# Altium schematic sheet EnergyMeter_ADE9153.SchDoc
size A; SheetNumber: 2; SheetTotal: 2
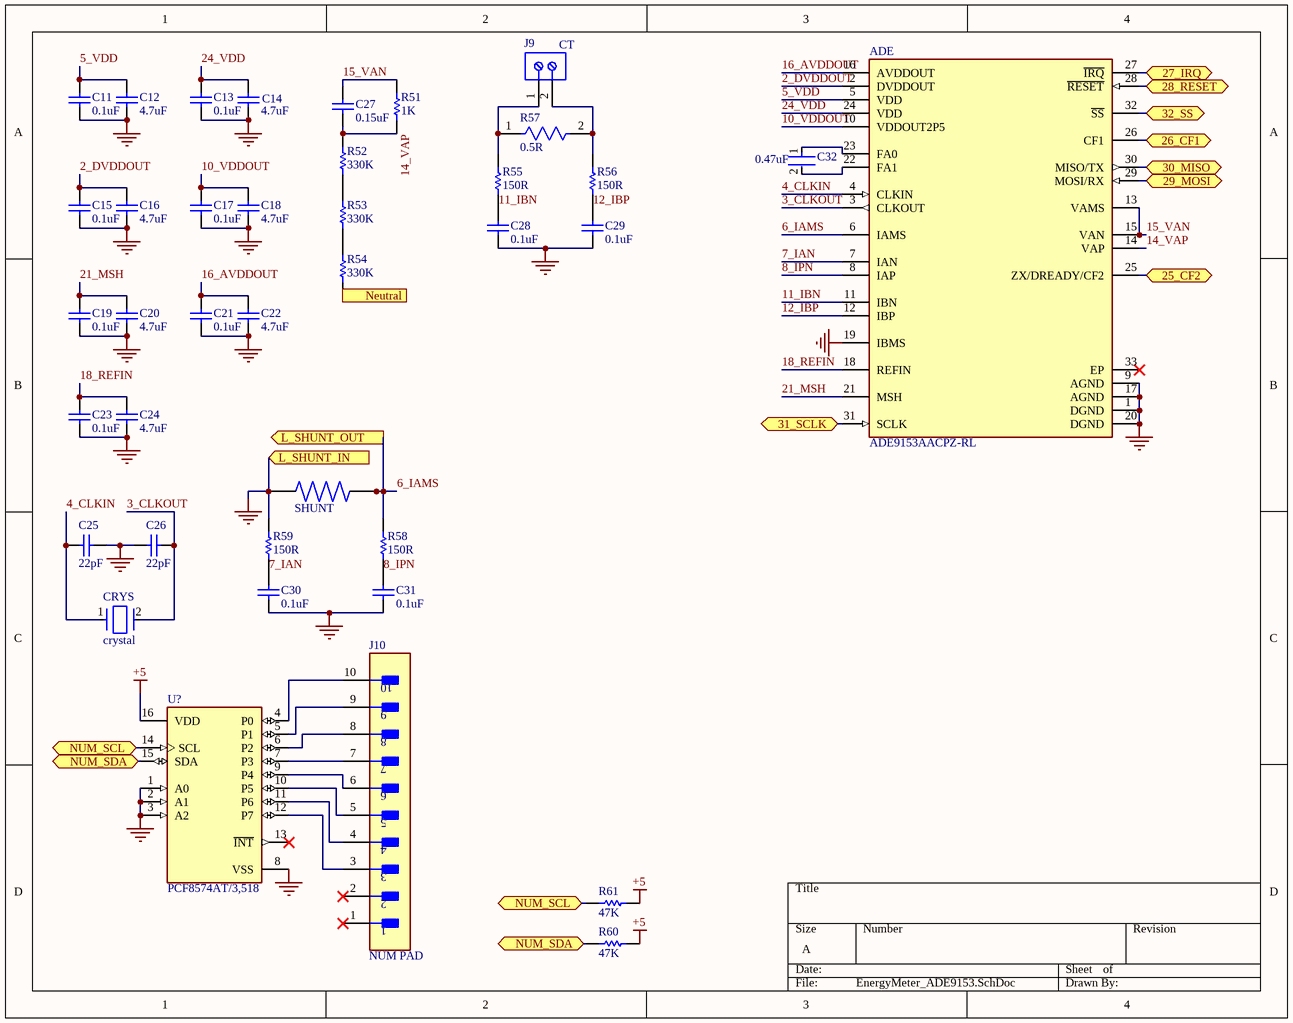
[diagram p0: EnergyMeter_ADE9153.SchDoc]

## Parts
ADE  ADE9153AACPZ-RL  [FP-CP-32-12-MFG]
C11  0.1uF  [CAPC2013X135X45ML10T25]
C12  4.7uF  [CAPC2013X135X45ML10T25]
C13  0.1uF  [CAPC2013X135X45ML10T25]
C14  4.7uF  [CAPC2013X135X45ML10T25]
C15  0.1uF  [CAPC2013X135X45ML10T25]
C16  4.7uF  [CAPC2013X135X45ML10T25]
C17  0.1uF  [CAPC2013X135X45ML10T25]
C18  4.7uF  [CAPC2013X135X45ML10T25]
C19  0.1uF  [CAPC2013X135X45ML10T25]
C20  4.7uF  [CAPC2013X135X45ML10T25]
C21  0.1uF  [CAPC2013X135X45ML10T25]
C22  4.7uF  [CAPC2013X135X45ML10T25]
C23  0.1uF  [CAPC2013X135X45ML10T25]
C24  4.7uF  [CAPC2013X135X45ML10T25]
C25  22pF  [CAPC2013X115X51NL20T26]
C26  22pF  [CAPC2013X115X51NL20T26]
C27  0.15uF  [CAPC2013X140X50LL20T25]
C28  0.1uF  [CAPC2013X135X45ML10T25]
C29  0.1uF  [CAPC2013X135X45ML10T25]
C30  0.1uF  [CAPC2013X135X45ML10T25]
C31  0.1uF  [CAPC2013X135X45ML10T25]
C32  0.47uF  [FP-C0805C-DN-MFG]
CRYS  crystal  [FP-CSM-7XDU-MFG]
J9  CT  [691214110002]
J10  NUM PAD  [FP-B10B-XH-A_LF_SN-MFG]
R51  1K  [RESC2013X60X35ML10T20]
R52  330K  [RESC2013X70X40LL20T20]
R53  330K  [RESC2013X70X40LL20T20]
R54  330K  [RESC2013X70X40LL20T20]
R55  150R  [RESC2013X60X40NL20T25]
R56  150R  [RESC2013X60X40NL20T25]
R57  0.5R  [FP-CSR0805-MFG]
R58  150R  [RESC2013X60X40NL20T25]
R59  150R  [RESC2013X60X40NL20T25]
R60  47K  [RESC2013X60X40ML20T25]
R61  47K  [RESC2013X60X40ML20T25]
SHUNT  SHUNT  [RES_WSK12161L000FEA]  (value not drawn)
U?  PCF8574AT/3,518  [FP-SOT162-1-MFG]

## Ports
25_CF2 (bidir, see Energy_meter_Sch[2D]), 26_CF1 (bidir, see Energy_meter_Sch[2D]), 27_IRQ (bidir, see Energy_meter_Sch[2C]), 28_RESET (bidir, see Energy_meter_Sch[2D]), 29_MOSI (bidir, see Energy_meter_Sch[2C]), 30_MISO (bidir, see Energy_meter_Sch[2C]), 31_SCLK (bidir, see Energy_meter_Sch[2C]), 32_SS (bidir, see Energy_meter_Sch[2C]), L_SHUNT_IN (in, see Energy_meter_Sch[4B]), L_SHUNT_OUT (out, see Energy_meter_Sch[2A]), Neutral (in, see Energy_meter_Sch[1B], Energy_meter_Sch[4B]), NUM_SCL (bidir, see Energy_meter_Sch[4C], EnergyMeter_ADE9153[1C]), NUM_SCL (bidir, see Energy_meter_Sch[4C], EnergyMeter_ADE9153[2D]), NUM_SDA (bidir, see Energy_meter_Sch[4C], EnergyMeter_ADE9153[1C]), NUM_SDA (bidir, see Energy_meter_Sch[4C], EnergyMeter_ADE9153[2D])

## Nets
+5: R60.2 R61.2 U?.16(VDD)
D: U?.8(VSS)
GND: ADE.1(DGND) ADE.9(AGND) ADE.17(AGND) ADE.19(IBMS) ADE.20(DGND) C11.1 C12.1 C13.1 C14.1 C15.1 C16.1 C17.1 C18.1 C19.1 C20.1 C21.1 C22.1 C23.1 C24.1 C25.2 C26.2 C28.1 C29.1 C30.1 C31.1 R59.2 SHUNT.3 SHUNT.4 U?.1(A0) U?.2(A1) U?.3(A2) ; port L_SHUNT_IN
2_DVDDOUT: ADE.2(DVDDOUT) C15.2 C16.2
3_CLKOUT: ADE.3(CLKOUT) C26.1 CRYS.2
4_CLKIN: ADE.4(CLKIN) C25.1 CRYS.1
5_VDD: ADE.5(VDD) C11.2 C12.2
6_IAMS: ADE.6(IAMS) R58.2 SHUNT.1 SHUNT.2 ; port L_SHUNT_OUT
7_IAN: ADE.7(IAN) C30.2 R59.1
8_IPN: ADE.8(IAP) C31.2 R58.1
10_VDDOUT: ADE.10(VDDOUT2P5) C17.2 C18.2
11_IBN: ADE.11(IBN) C28.2 R55.1
12_IBP: ADE.12(IBP) C29.2 R56.1
14_VAP: ADE.14(VAP) C27.1 R51.1 R52.2
15_VAN: ADE.13(VAMS) ADE.15(VAN) C27.2 R51.2
16_AVDDOUT: ADE.16(AVDDOUT) C21.2 C22.2
18_REFIN: ADE.18(REFIN) C23.2 C24.2
21_MSH: ADE.21(MSH) C19.2 C20.2
24_VDD: ADE.24(VDD) C13.2 C14.2
25_CF2: ADE.25(ZX/DREADY/CF2) ; port 25_CF2
26_CF1: ADE.26(CF1) ; port 26_CF1
27_IRQ: ADE.27(~{IRQ}) ; port 27_IRQ
28_RESET: ADE.28(~{RESET}) ; port 28_RESET
29_MOSI: ADE.29(MOSI/RX) ; port 29_MOSI
30_MISO: ADE.30(MISO/TX) ; port 30_MISO
31_SCLK: ADE.31(SCLK) ; port 31_SCLK
32_SS: ADE.32(~{SS}) ; port 32_SS
Neutral: R54.1 ; port Neutral
NUM_SCL: R61.1 U?.14(SCL) ; port NUM_SCL
NUM_SDA: R60.1 U?.15(SDA) ; port NUM_SDA
NetADE_22: ADE.22(FA1) C32.2
NetADE_23: ADE.23(FA0) C32.1
NetJ9_1: J9.1 R55.2 R57.1
NetJ9_2: J9.2 R56.2 R57.2
NetJ10_3: J10.3 U?.12(P7)
NetJ10_4: J10.4 U?.11(P6)
NetJ10_5: J10.5 U?.10(P5)
NetJ10_6: J10.6 U?.9(P4)
NetJ10_7: J10.7 U?.7(P3)
NetJ10_8: J10.8 U?.6(P2)
NetJ10_9: J10.9 U?.5(P1)
NetJ10_10: J10.10 U?.4(P0)
NetR52_1: R52.1 R53.2
NetR53_1: R53.1 R54.2

Not connected (* = marked no-connect by the designer): ADE 33(EP)*; J10 1* 2*; U? 13(~{INT})*

## Library data of the parts
ADE = CMP-09081-000635-1: 1 PH MTR IC W/AUTO CALIBRATION; Operating Supply Current: 9.3mA; Input Impedance: 256kR; Mount: Surface Mount; Packaging: Tape and Reel; RoHS Compliant: Yes; Number of Pins: 32; Min Operating Temperature: -40°C; Series: -; Max Operating Temperature: 85°C
C11 C13 C15 C17 C19 C21 C23 C28-C31 = CMP-2100-03644-1: Chip Capacitor, 0.1 uF, +/- 10%, 50 V, -55 to 125 degC, 0805 (2012 Metric), RoHS, Tape and Reel; Manufacturer: Murata; Voltage: 50V; Capacitance: 100nF; Insulation Resistance: 10GR; Dielectric Material: Ceramic; Dielectric: X7R; Package Description: 2-Pin Surface Mount Device, Body 2 x 1.25 mm; Manufacturer URL: http://www.murata.com/; Case Code (Imperial): 0805; Datasheet URL: http://psearch.en.murata.com/capacitor/product/GRM21BR71H104KA01%23.pdf; Termination: SMD/SMT; Lead Free: LeadFree; Package Quantity: 1; Mount: SurfaceMount; REACH SVHC: Unknown; Thickness: 0.053inch; Height: 1.25mm; Case/Package: 0805; Voltage Rating: 50V; Width: 0.049inch; Case Code (Metric): 2012; Material: Ceramic; Min Operating Temperature: -55degC; RoHSCompliant: true; Datasheet Version: 42675.0; Voltage Rating (DC): 50V; Tolerance: 10%; Package Reference: 0805; Depth: 1.25mm; Length: 2mm; Max Operating Temperature: 125degC; Packaging: TapeandReel; Number of Pins: 2; Radiation Hardening: No
C12 C14 C16 C18 C20 C22 C24 = CMP-2007-03546-1: Manufacturer: Murata; Part Number: GRM21BR61E475MA12L
C25 C26 = CMP-2007-04866-1: Manufacturer: AVX Interconnect / Elco; Part Number: 08052U220GAT2A
C27 = CMP-1036-04480-3: Manufacturer: AVX Interconnect / Elco; Part Number: 08053C154KAT2A
C32 = CMP-1036-04645-2: CAP CER 0.47UF 25V X7R 0805; Manufacturer: KEMET; Manufacturer Part Number: C0805C474K3RACTU; Material: Ceramic; Value: 0.47 μF; Tolerance: 0.1; Temperature Coefficient: 30ppm/°C; Lead Free: Yes; Device Class L1: Passive Components; ComponentLink2Description: Datasheet; Category: Cap; Temperature: -55°C to +125°C; RoHS: TRUE; Capacitance: 0.47 μF; Automotive: No; Height: 0.88mm; Digikey Description: CAP CER 0.47UF 25V X7R 0805; Device Class L3: Ceramic Capacitors; Package: C0805C-DN; Voltage Rating: 25 V; Octopart: https://octopart.com/c0805c474k3ractu-kemet-90785; Temperature Characteristic: X7R; Temperature Range Low: -55°C; Temperature Range High: +125°C; Device Class L2: Capacitors; Ipc Land Pattern Name: CAPC200125X78; ComponentLink2URL: https://content.kemet.com/datasheets/KEM_C1003_C0G_SMD.pdf
CRYS = CMP-00466-07122495-1: ECS-120-18-5PXDU-TR Crystal 12MHz ±30ppm (Tol) ±100ppm (Stability) 18pF FUND 50Ohm 2-Pin SMD T/R; Tolerance: 0.003%; ESR (Equivalent Series Resistance): 50Ω; Termination: SMD/SMT; Width: 4.8006mm; Length: 11.4046mm; Packaging: Tape & Reel (TR); Max Operating Temperature: 125°C; Load Capacitance: 18pF; Frequency Stability: 100ppm; Lead Free: Lead Free; Min Operating Temperature: -55°C; RoHS: Compliant; Frequency: 12MHz; Schedule B: 8541600025, 8541600025; Frequency Tolerance: 0.003%; Mount: Surface Mount; Height: 4.2926mm; NexarPartId: 7122495
J9 = CMP-1502-02464-2: NexarPartId: 18818288; Plating: Brass, Steel; Current: 10A; Pitch: 3.5052mm; Number of Levels: 1; Number of Contacts: 2; Wire Gauge (Min): 16AWG; Voltage: 300V; Wire Gauge (Max): 24AWG; Stripping Length: -6mm; Number of Pins: 2; Number of Rows: 1; REACH SVHC: Unknown; RoHS: Compliant; Housing Material: Nylon; Termination: Screw; Mount: Through Hole; Contact Plating: Brass, Tin; Number of Positions Per Level: 2; Color: Blue, Green; Width: 7.9mm; Voltage Rating: 300V; Length: 7.4mm; Current Rating: 10A; Wire/Cable Gauge: 24AWG; Packaging: Box; Max Operating Temperature: 105°C; Lead Pitch: 3.5mm; Height: 8.7mm; Contact Material: Brass; Min Operating Temperature: -40°C
J10 = CMP-17439-000145-1: CONN HEADER VERT 10POS 2.5MM; Voltage Rating: 250V; Current Rating: 3A; Wire/Cable Gauge: 22AWG; Number of Contacts: 10; Contact Resistance: 20mR; Mated Stacking Heights: 9.8mm; Gender: Male; Insulation Resistance: 1GR; Series: XH; Max Current Rating: 3A; Contact Shape: Square; Contact Material: Brass; Housing Material: Polyamide; Lead Free: Lead Free; Orientation: Straight; Max Voltage Rating (DC): 250V; Contact Type: Male Pin; Number of Positions: 10; Length: 27.4mm; Housing Color: White; Max Voltage Rating (AC): 250V; Depth: 5.75mm; Mount: Through Hole; Pitch: 2.5mm; Fastening Type: Detent; Flammability Rating: UL94 V-0; Color: Natural; Contact Plating: Tin; Insulation Color: Natural; Packaging: Bulk; REACH SVHC: No SVHC; Insulation Material: Nylon; Connector Type: Header; Lead Pitch: 2.5mm; Contact Finish - Mating: TIN; Voltage Rating (AC): 250V; Number of Rows: 1; Max Operating Temperature: 85°C; Min Operating Temperature: -25°C; Termination: Solder
R51 = CMP-2100-03671-1: Chip Resistor, 1 KOhm, +/- 1%, 125 mW, -55 to 155 degC, 0805 (2012 Metric), RoHS, Tape and Reel; Manufacturer: Yageo; Temperature Coefficient: 100ppm/degreesC; Voltage Rating (DC): 150V; Max Power Dissipation: 125mW; Resistance: 1KOhm; Number of Pins: 2; Number of Terminations: 2; Datasheet URL: http://www.yageo.com/NewPortal/yageodocoutput?fileName=/pdf/R-Chip/PYu-RC_Group_51_RoHS_L_5.pdf; Length: 0.079inch; Package Description: 2-Pin Surface Mounted Device, Body 2 x 1.25 mm; Depth: 1.25mm; Height: 0.024inch; Military Standard: Not; Case/Package: 0805; Package Reference: 0805; RoHSCompliant: true; Lead Free: LeadFree; Packaging: TapeandReel; Package Quantity: 1; Datasheet Version: Rev. 5, 10/2016; Tolerance: 1%; Min Operating Temperature: -55degC; Voltage Rating: 150V; Composition: ThickFilm; Case Code (Imperial): 0805; Power Rating: 125mW; Width: 0.049inch; Case Code (Metric): 2012; Manufacturer URL: http://www.yageo.com/; Max Operating Temperature: 155degC; REACH SVHC: Unknown; Termination: SMD/SMT
R52-R54 = CMP-2001-00535-1: Manufacturer: Panasonic; Part Number: ERJ6ENF3303V
R55 R56 R58 R59 = CMP-2001-00596-1: Manufacturer: Panasonic; Part Number: ERA6AEB151V
R57 = CMP-26527-003152-1: General Purpose Thick Film Chip Resistor, 0805, 0.5Ω, 5%, 200ppm/°C, 0.25W; RoHS Compliant: Yes; Max Operating Temperature: 155°C; Min Operating Temperature: -55°C; Tolerance: 5%; Mount: Surface Mount; Packaging: Tape and Reel
R60 R61 = CMP-2001-00590-1: Part Number: ERA6AEB123V; Manufacturer: Panasonic
SHUNT = WSK12161L000FEA: 1 mOhms Â±1% 3W Chip Resistor Wide 1612 (3831 Metric), 1216 Current Sense, Moisture Resistant, Pulse Withstanding Metal Element; MF: Vishay Dale; MP: WSK12161L000FEA; Package: 1216 Vishay Dale; Purchase-URL: https://pricing.snapeda.com/search/part/WSK12161L000FEA/?ref=eda; Check_prices: https://www.snapeda.com/parts/WSK12161L000FEA/Vishay%20Dale/view-part/3217927/?ref=eda; Digi-Key_Part_Number: 541-3133-1-ND; SnapEDA_Link: https://www.snapeda.com/parts/WSK12161L000FEA/Vishay%20Dale/view-part/3217927/?ref=snap; Value: *
U? = CMP-10112-000003-1: IC I/O EXPANDER I2C 8B 16SOIC; Manufacturer: NXP Semiconductors; Interface: I2C,SMBus; Frequency: 100kHz; Nominal Supply Current: 40uA; Max Supply Voltage: 6V; Number Of I/Os: 8; Max Junction Temp: +125°C; Min Supply Voltage: 2.5V; Standoff Height: 0.1mm; RoHS: TRUE; Category: IC; Temperature: -40°C to +85°C; Device Class L3: I/O Expanders; ComponentLink2Description: Datasheet; ComponentLink2URL: https://www.nxp.com/docs/en/data-sheet/PCF8574_PCF8574A.pdf; Digikey Description: IC I/O EXPANDER I2C 8B 16SOIC; Ipc Land Pattern Name: SOIC127P1032X265-16; Mouser Description: PCF8574 Series 2.5 to 6V Remote 8-bit I/O Expander for I2C-bus -SOIC-16; Footprint Url: https://www.nxp.com/docs/en/package-information/SOT162-1.pdf; Lead Free: Yes; Device Class L2: Interface ICs; Ambient Temperature Range Low: -40°C; Temperature Range High: +85°C; Automotive: No; Manufacturer Part Number: PCF8574AT/3,518; Ambient Temperature Range High: +85°C; Height: 2.65mm; Package: SOT162-1; Temperature Range Low: -40°C; Octopart: https://octopart.com/pcf8574at%2F3%2C518-nxp+semiconductors-11541925; Device Class L1: Integrated Circuits (ICs)